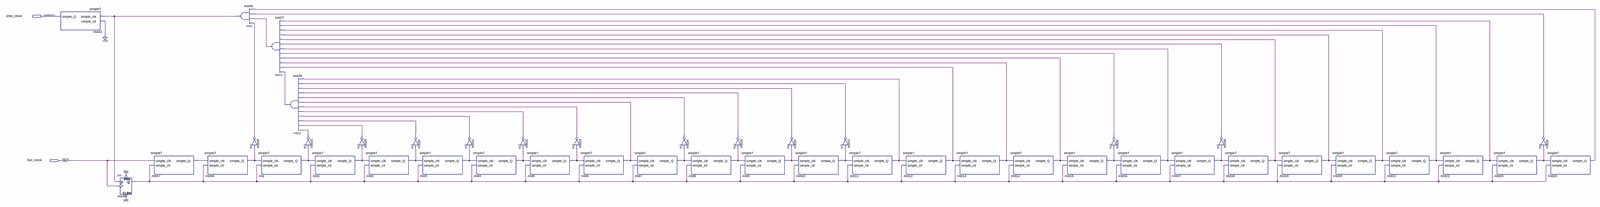
[diagram p0: schematic sheet, whole]
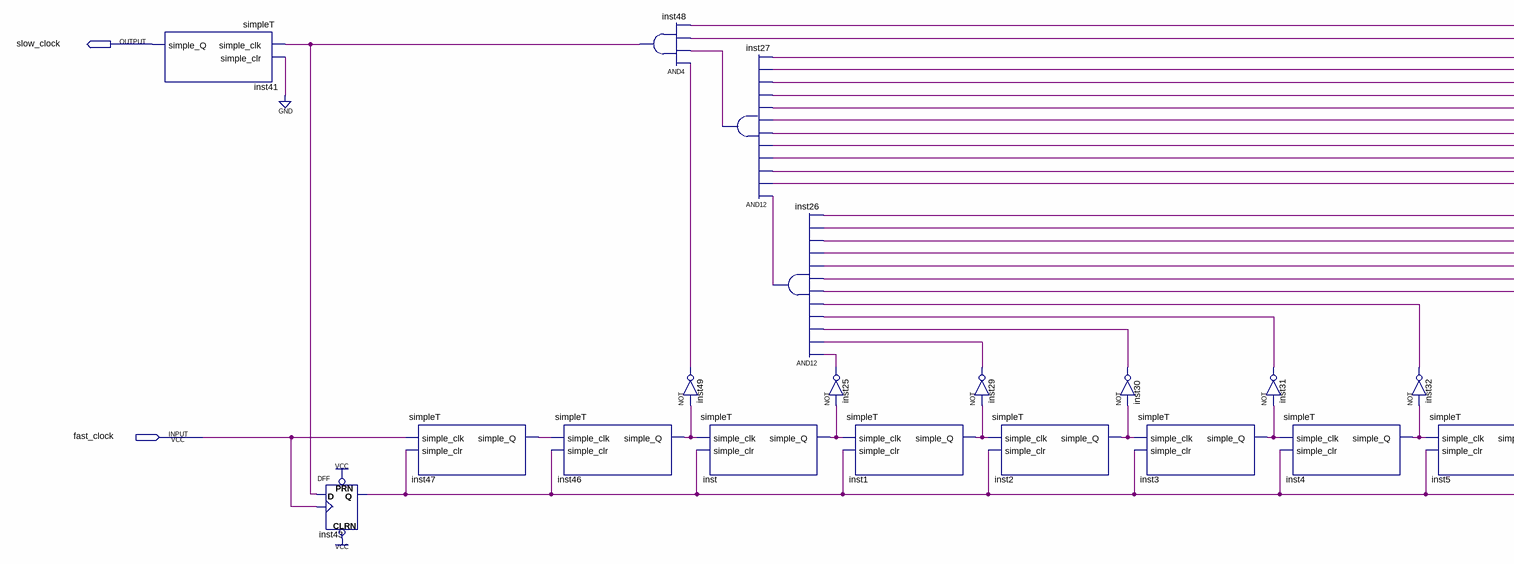
[diagram p1: schematic sheet, left part]
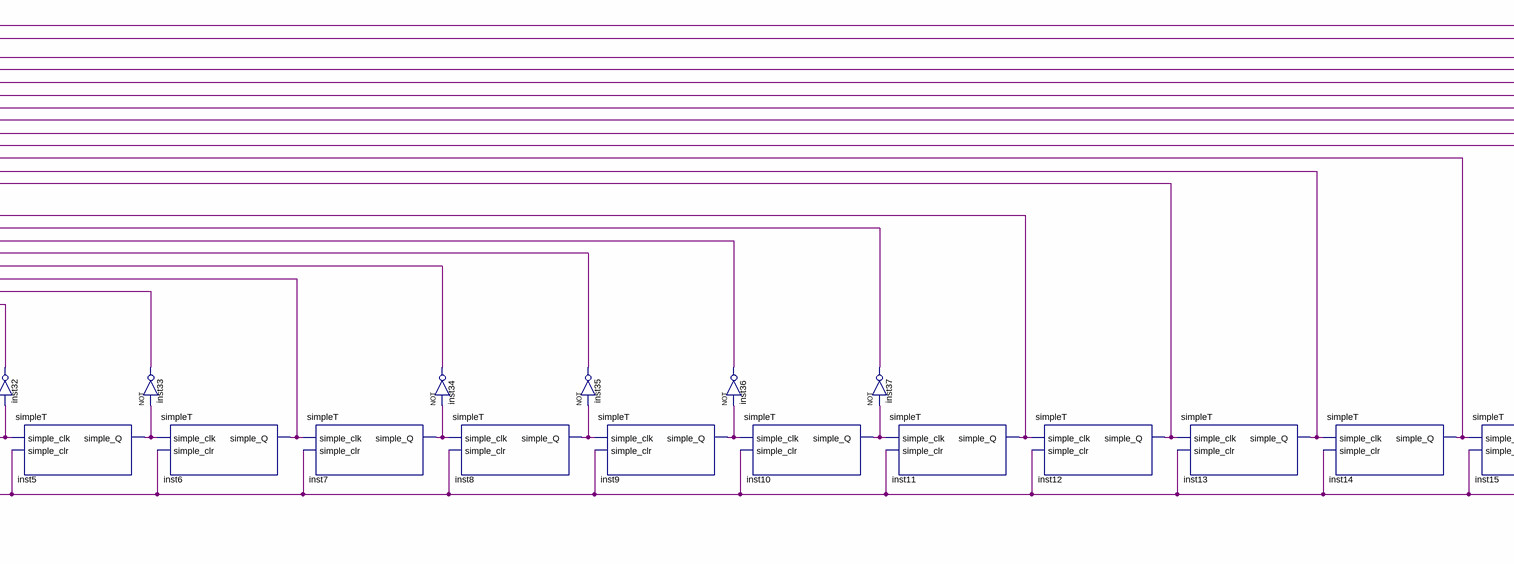
[diagram p2: schematic sheet, centre part]
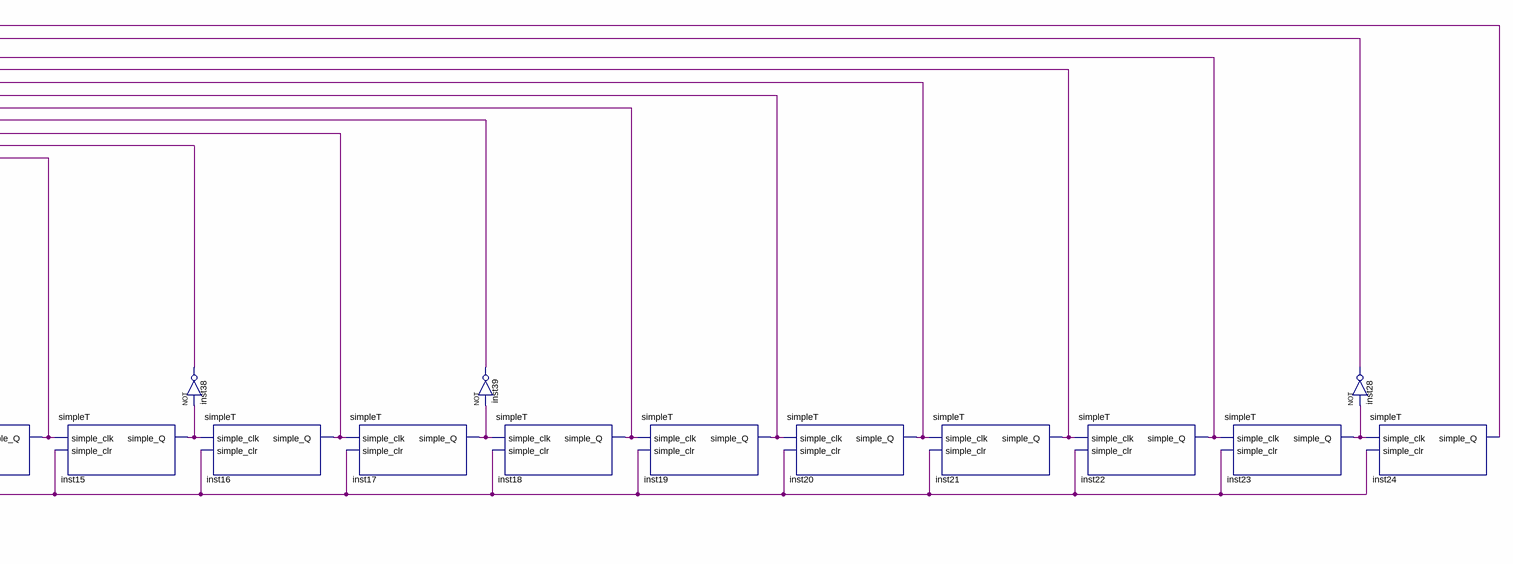
[diagram p3: schematic sheet, right part]
// Quartus schematic clk_trimmer.bdf as structural Verilog: 46 symbols, 2 pins
module clk_trimmer (
  input  fast_clock,
  output slow_clock
);

  wire inst1_simple_q, inst2_simple_q, inst3_simple_q, inst4_simple_q, inst5_simple_q, inst6_simple_q,
       inst7_simple_q, inst8_simple_q, inst9_simple_q, inst10_simple_q, inst11_simple_q, inst12_simple_q,
       inst13_simple_q, inst14_simple_q, inst15_simple_q, inst16_simple_q, inst17_simple_q, inst18_simple_q,
       inst19_simple_q, inst20_simple_q, inst21_simple_q, inst22_simple_q, inst23_simple_q, inst24_simple_q,
       inst25_out, inst26_out, inst27_out, inst28_out, inst29_out, inst30_out, inst31_out, inst32_out,
       inst33_out, inst34_out, inst35_out, inst36_out, inst37_out, inst38_out, inst39_out, inst43_q,
       inst46_simple_q, inst47_simple_q, inst48_out, inst49_out, inst_simple_q;

  simpleT inst41 (.simple_clk(inst48_out), .simple_clr(1'b0), .simple_Q(slow_clock));
  DFF inst43 (.CLRN(1'b1), .CLK(fast_clock), .D(inst48_out), .PRN(1'b1), .Q(inst43_q));
  simpleT inst47 (.simple_clk(fast_clock), .simple_clr(inst43_q), .simple_Q(inst47_simple_q));
  simpleT inst46 (.simple_clk(inst47_simple_q), .simple_clr(inst43_q), .simple_Q(inst46_simple_q));
  and inst48 (inst48_out, inst49_out, inst27_out, inst28_out, inst24_simple_q);
  not inst49 (inst49_out, inst46_simple_q);
  and inst27 (inst27_out, inst26_out, inst12_simple_q, inst13_simple_q, inst14_simple_q, inst38_out, inst16_simple_q, inst39_out, inst18_simple_q, inst19_simple_q, inst20_simple_q, inst21_simple_q, inst22_simple_q);
  simpleT inst (.simple_clk(inst46_simple_q), .simple_clr(inst43_q), .simple_Q(inst_simple_q));
  and inst26 (inst26_out, inst25_out, inst29_out, inst30_out, inst31_out, inst32_out, inst33_out, inst6_simple_q, inst34_out, inst35_out, inst36_out, inst37_out, inst11_simple_q);
  not inst25 (inst25_out, inst_simple_q);
  simpleT inst1 (.simple_clk(inst_simple_q), .simple_clr(inst43_q), .simple_Q(inst1_simple_q));
  not inst29 (inst29_out, inst1_simple_q);
  simpleT inst2 (.simple_clk(inst1_simple_q), .simple_clr(inst43_q), .simple_Q(inst2_simple_q));
  not inst30 (inst30_out, inst2_simple_q);
  simpleT inst3 (.simple_clk(inst2_simple_q), .simple_clr(inst43_q), .simple_Q(inst3_simple_q));
  not inst31 (inst31_out, inst3_simple_q);
  simpleT inst4 (.simple_clk(inst3_simple_q), .simple_clr(inst43_q), .simple_Q(inst4_simple_q));
  not inst32 (inst32_out, inst4_simple_q);
  simpleT inst5 (.simple_clk(inst4_simple_q), .simple_clr(inst43_q), .simple_Q(inst5_simple_q));
  not inst33 (inst33_out, inst5_simple_q);
  simpleT inst6 (.simple_clk(inst5_simple_q), .simple_clr(inst43_q), .simple_Q(inst6_simple_q));
  simpleT inst7 (.simple_clk(inst6_simple_q), .simple_clr(inst43_q), .simple_Q(inst7_simple_q));
  not inst34 (inst34_out, inst7_simple_q);
  simpleT inst8 (.simple_clk(inst7_simple_q), .simple_clr(inst43_q), .simple_Q(inst8_simple_q));
  not inst35 (inst35_out, inst8_simple_q);
  simpleT inst9 (.simple_clk(inst8_simple_q), .simple_clr(inst43_q), .simple_Q(inst9_simple_q));
  not inst36 (inst36_out, inst9_simple_q);
  simpleT inst10 (.simple_clk(inst9_simple_q), .simple_clr(inst43_q), .simple_Q(inst10_simple_q));
  not inst37 (inst37_out, inst10_simple_q);
  simpleT inst11 (.simple_clk(inst10_simple_q), .simple_clr(inst43_q), .simple_Q(inst11_simple_q));
  simpleT inst12 (.simple_clk(inst11_simple_q), .simple_clr(inst43_q), .simple_Q(inst12_simple_q));
  simpleT inst13 (.simple_clk(inst12_simple_q), .simple_clr(inst43_q), .simple_Q(inst13_simple_q));
  simpleT inst14 (.simple_clk(inst13_simple_q), .simple_clr(inst43_q), .simple_Q(inst14_simple_q));
  simpleT inst15 (.simple_clk(inst14_simple_q), .simple_clr(inst43_q), .simple_Q(inst15_simple_q));
  not inst38 (inst38_out, inst15_simple_q);
  simpleT inst16 (.simple_clk(inst15_simple_q), .simple_clr(inst43_q), .simple_Q(inst16_simple_q));
  simpleT inst17 (.simple_clk(inst16_simple_q), .simple_clr(inst43_q), .simple_Q(inst17_simple_q));
  not inst39 (inst39_out, inst17_simple_q);
  simpleT inst18 (.simple_clk(inst17_simple_q), .simple_clr(inst43_q), .simple_Q(inst18_simple_q));
  simpleT inst19 (.simple_clk(inst18_simple_q), .simple_clr(inst43_q), .simple_Q(inst19_simple_q));
  simpleT inst20 (.simple_clk(inst19_simple_q), .simple_clr(inst43_q), .simple_Q(inst20_simple_q));
  simpleT inst21 (.simple_clk(inst20_simple_q), .simple_clr(inst43_q), .simple_Q(inst21_simple_q));
  simpleT inst22 (.simple_clk(inst21_simple_q), .simple_clr(inst43_q), .simple_Q(inst22_simple_q));
  simpleT inst23 (.simple_clk(inst22_simple_q), .simple_clr(inst43_q), .simple_Q(inst23_simple_q));
  not inst28 (inst28_out, inst23_simple_q);
  simpleT inst24 (.simple_clk(inst23_simple_q), .simple_clr(inst43_q), .simple_Q(inst24_simple_q));
endmodule
